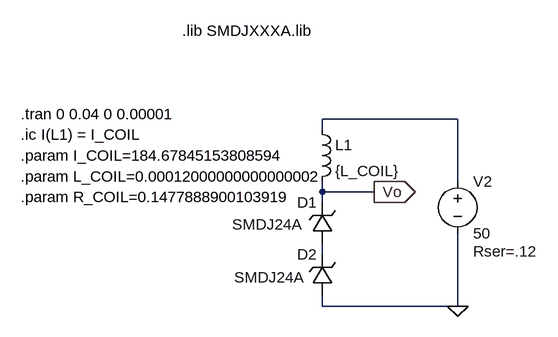
[diagram p0: schematic offTime.asc]
offTime.asc, the LTspice schematic file:
Version 4
SHEET 1 1228 680
WIRE 800 -16 592 -16
WIRE 592 0 592 -16
WIRE 800 80 800 -16
WIRE 592 96 592 80
WIRE 672 96 592 96
WIRE 592 112 592 96
WIRE 592 192 592 176
WIRE 592 272 592 256
WIRE 800 272 800 160
WIRE 800 272 592 272
FLAG 672 96 Vo
IOPIN 672 96 Out
FLAG 800 272 0
SYMBOL voltage 800 64 R0
WINDOW 123 0 0 Left 0
WINDOW 39 24 124 Left 2
SYMATTR SpiceLine Rser=.12
SYMATTR InstName V2
SYMATTR Value 50
SYMBOL ind 576 -16 R0
SYMATTR InstName L1
SYMATTR Value {L_COIL}
SYMATTR SpiceLine Rser={R_COIL} Cpar=1e-9
SYMBOL zener 608 176 R180
WINDOW 0 24 64 Left 2
WINDOW 3 47 30 Left 2
SYMATTR InstName D1
SYMATTR Value SMDJ24A
SYMATTR Prefix X
SYMBOL zener 608 256 R180
WINDOW 0 24 64 Left 2
WINDOW 3 44 28 Left 2
SYMATTR InstName D2
SYMATTR Value SMDJ24A
SYMATTR Prefix X
TEXT 128 -24 Left 2 !.tran 0 0.04 0 0.00001
TEXT 376 -152 Left 2 !.lib SMDJXXXA.lib
TEXT 128 8 Left 2 !.ic I(L1) = I_COIL
TEXT 128 40 Left 2 !.param I_COIL=184.67845153808594
TEXT 128 72 Left 2 !.param L_COIL=0.00012000000000000002
TEXT 128 104 Left 2 !.param R_COIL=0.1477888900103919

The netlist it stands for:
* offTime.asc
V2 N001 0 50 Rser=.12
L1 N001 Vo {L_COIL} Rser={R_COIL} Cpar=1e-9
XD1 N002 Vo SMDJ24A  ; pins + -
XD2 0 N002 SMDJ24A  ; pins + -
.tran 0 0.04 0 0.00001
.lib SMDJXXXA.lib
.ic I(L1) = I_COIL
.param I_COIL=184.67845153808594
.param L_COIL=0.00012000000000000002
.param R_COIL=0.1477888900103919
.backanno
.end